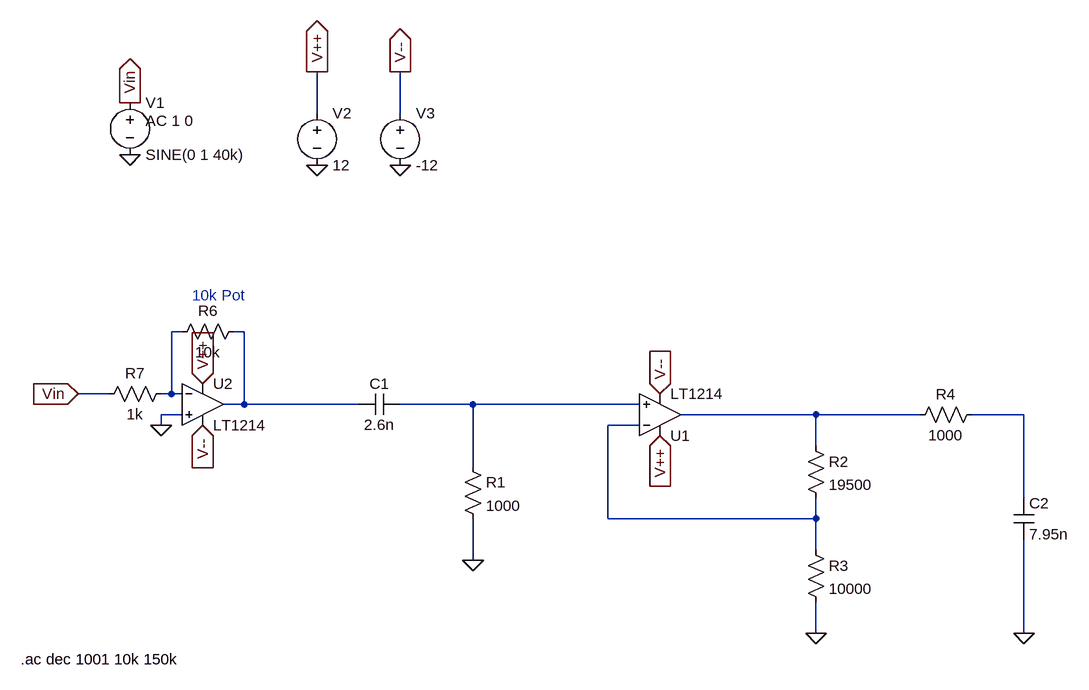
[diagram p0: schematic draftBandpassActiveElectronicsTutorials.asc]
draftBandpassActiveElectronicsTutorials.asc, the LTspice schematic file:
Version 4
SHEET 1 1148 680
WIRE -16 -320 -16 -384
WIRE 112 -320 112 -384
WIRE -224 16 -240 16
WIRE -128 16 -144 16
WIRE -336 112 -384 112
WIRE -240 112 -240 16
WIRE -240 112 -256 112
WIRE -224 112 -240 112
WIRE -128 128 -128 16
WIRE -128 128 -160 128
WIRE 48 128 -128 128
WIRE 224 128 112 128
WIRE 480 128 224 128
WIRE -224 144 -256 144
WIRE 752 144 544 144
WIRE 912 144 752 144
WIRE 1072 144 992 144
WIRE -256 160 -256 144
WIRE 480 160 432 160
WIRE 752 192 752 144
WIRE 224 224 224 128
WIRE 1072 272 1072 144
WIRE 432 304 432 160
WIRE 752 304 752 272
WIRE 752 304 432 304
WIRE 752 352 752 304
WIRE 224 368 224 304
WIRE 752 480 752 432
WIRE 1072 480 1072 336
FLAG -16 -240 0
FLAG 112 -240 0
FLAG -16 -384 V++
IOPIN -16 -384 Out
FLAG 112 -384 V--
IOPIN 112 -384 Out
FLAG -304 -256 0
FLAG -304 -336 Vin
IOPIN -304 -336 Out
FLAG -256 160 0
FLAG -192 160 V--
IOPIN -192 160 In
FLAG -192 96 V++
IOPIN -192 96 In
FLAG -384 112 Vin
IOPIN -384 112 In
FLAG 512 176 V++
IOPIN 512 176 In
FLAG 512 112 V--
IOPIN 512 112 In
FLAG 752 480 0
FLAG 1072 480 0
FLAG 224 368 0
SYMBOL voltage -16 -336 R0
WINDOW 123 0 0 Left 0
WINDOW 39 0 0 Left 0
SYMATTR InstName V2
SYMATTR Value 12
SYMBOL voltage 112 -336 R0
WINDOW 123 0 0 Left 0
WINDOW 39 0 0 Left 0
SYMATTR InstName V3
SYMATTR Value -12
SYMBOL voltage -304 -352 R0
WINDOW 123 24 44 Left 2
WINDOW 39 0 0 Left 0
SYMATTR InstName V1
SYMATTR Value SINE(0 1 40k)
SYMATTR Value2 AC 1 0
SYMBOL Opamps\\LT1214 -192 64 R0
SYMATTR InstName U2
SYMBOL res -128 0 R90
WINDOW 0 0 56 VBottom 2
WINDOW 3 32 56 VTop 2
SYMATTR InstName R6
SYMATTR Value 10k
SYMBOL res -240 96 R90
WINDOW 0 0 56 VBottom 2
WINDOW 3 32 56 VTop 2
SYMATTR InstName R7
SYMATTR Value 1k
SYMBOL Opamps\\LT1214 512 208 M180
SYMATTR InstName U1
SYMBOL cap 112 112 R90
WINDOW 0 0 32 VBottom 2
WINDOW 3 32 32 VTop 2
SYMATTR InstName C1
SYMATTR Value 2.6n
SYMBOL res 208 208 R0
SYMATTR InstName R1
SYMATTR Value 1000
SYMBOL res 736 176 R0
SYMATTR InstName R2
SYMATTR Value 19500
SYMBOL res 736 336 R0
SYMATTR InstName R3
SYMATTR Value 10000
SYMBOL cap 1056 272 R0
SYMATTR InstName C2
SYMATTR Value 7.95n
SYMBOL res 1008 128 R90
WINDOW 0 0 56 VBottom 2
WINDOW 3 32 56 VTop 2
SYMATTR InstName R4
SYMATTR Value 1000
TEXT -472 520 Left 2 !.ac dec 1001 10k 150k
TEXT -208 -40 Left 2 ;10k Pot

The netlist it stands for:
* draftBandpassActiveElectronicsTutorials.asc
V2 V++ 0 12
V3 V-- 0 -12
V1 Vin 0 SINE(0 1 40k) AC 1 0
XU2 0 N001 V++ V-- N002 LT1213  ; LT1214, pins In+ In- V+ V- OUT
R6 N002 N001 10k
R7 N001 Vin 1k
XU1 N003 N006 V++ V-- N004 LT1213  ; LT1214, pins In+ In- V+ V- OUT
C1 N003 N002 2.6n
R1 N003 0 1000
R2 N004 N006 19500
R3 N006 0 10000
C2 N005 0 7.95n
R4 N005 N004 1000
.ac dec 1001 10k 150k
* 10k Pot
.lib LTC.lib
.backanno
.end